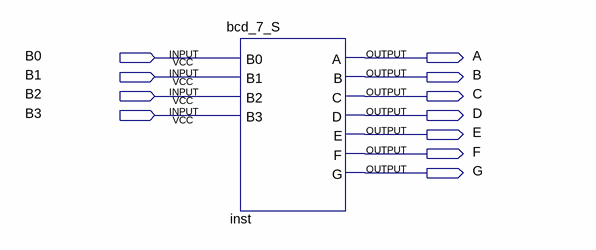
[diagram p0: schematic sheet]
// Quartus schematic BCD7S.bdf as structural Verilog: 1 symbols, 11 pins
module BCD7S (
  input  B0,
  input  B1,
  input  B2,
  input  B3,
  output A,
  output B,
  output C,
  output D,
  output E,
  output F,
  output G
);

  bcd_7_S inst (.B0(B0), .B1(B1), .B2(B2), .B3(B3), .A(A), .B(B), .C(C), .D(D), .E(E), .F(F), .G(G));
endmodule
